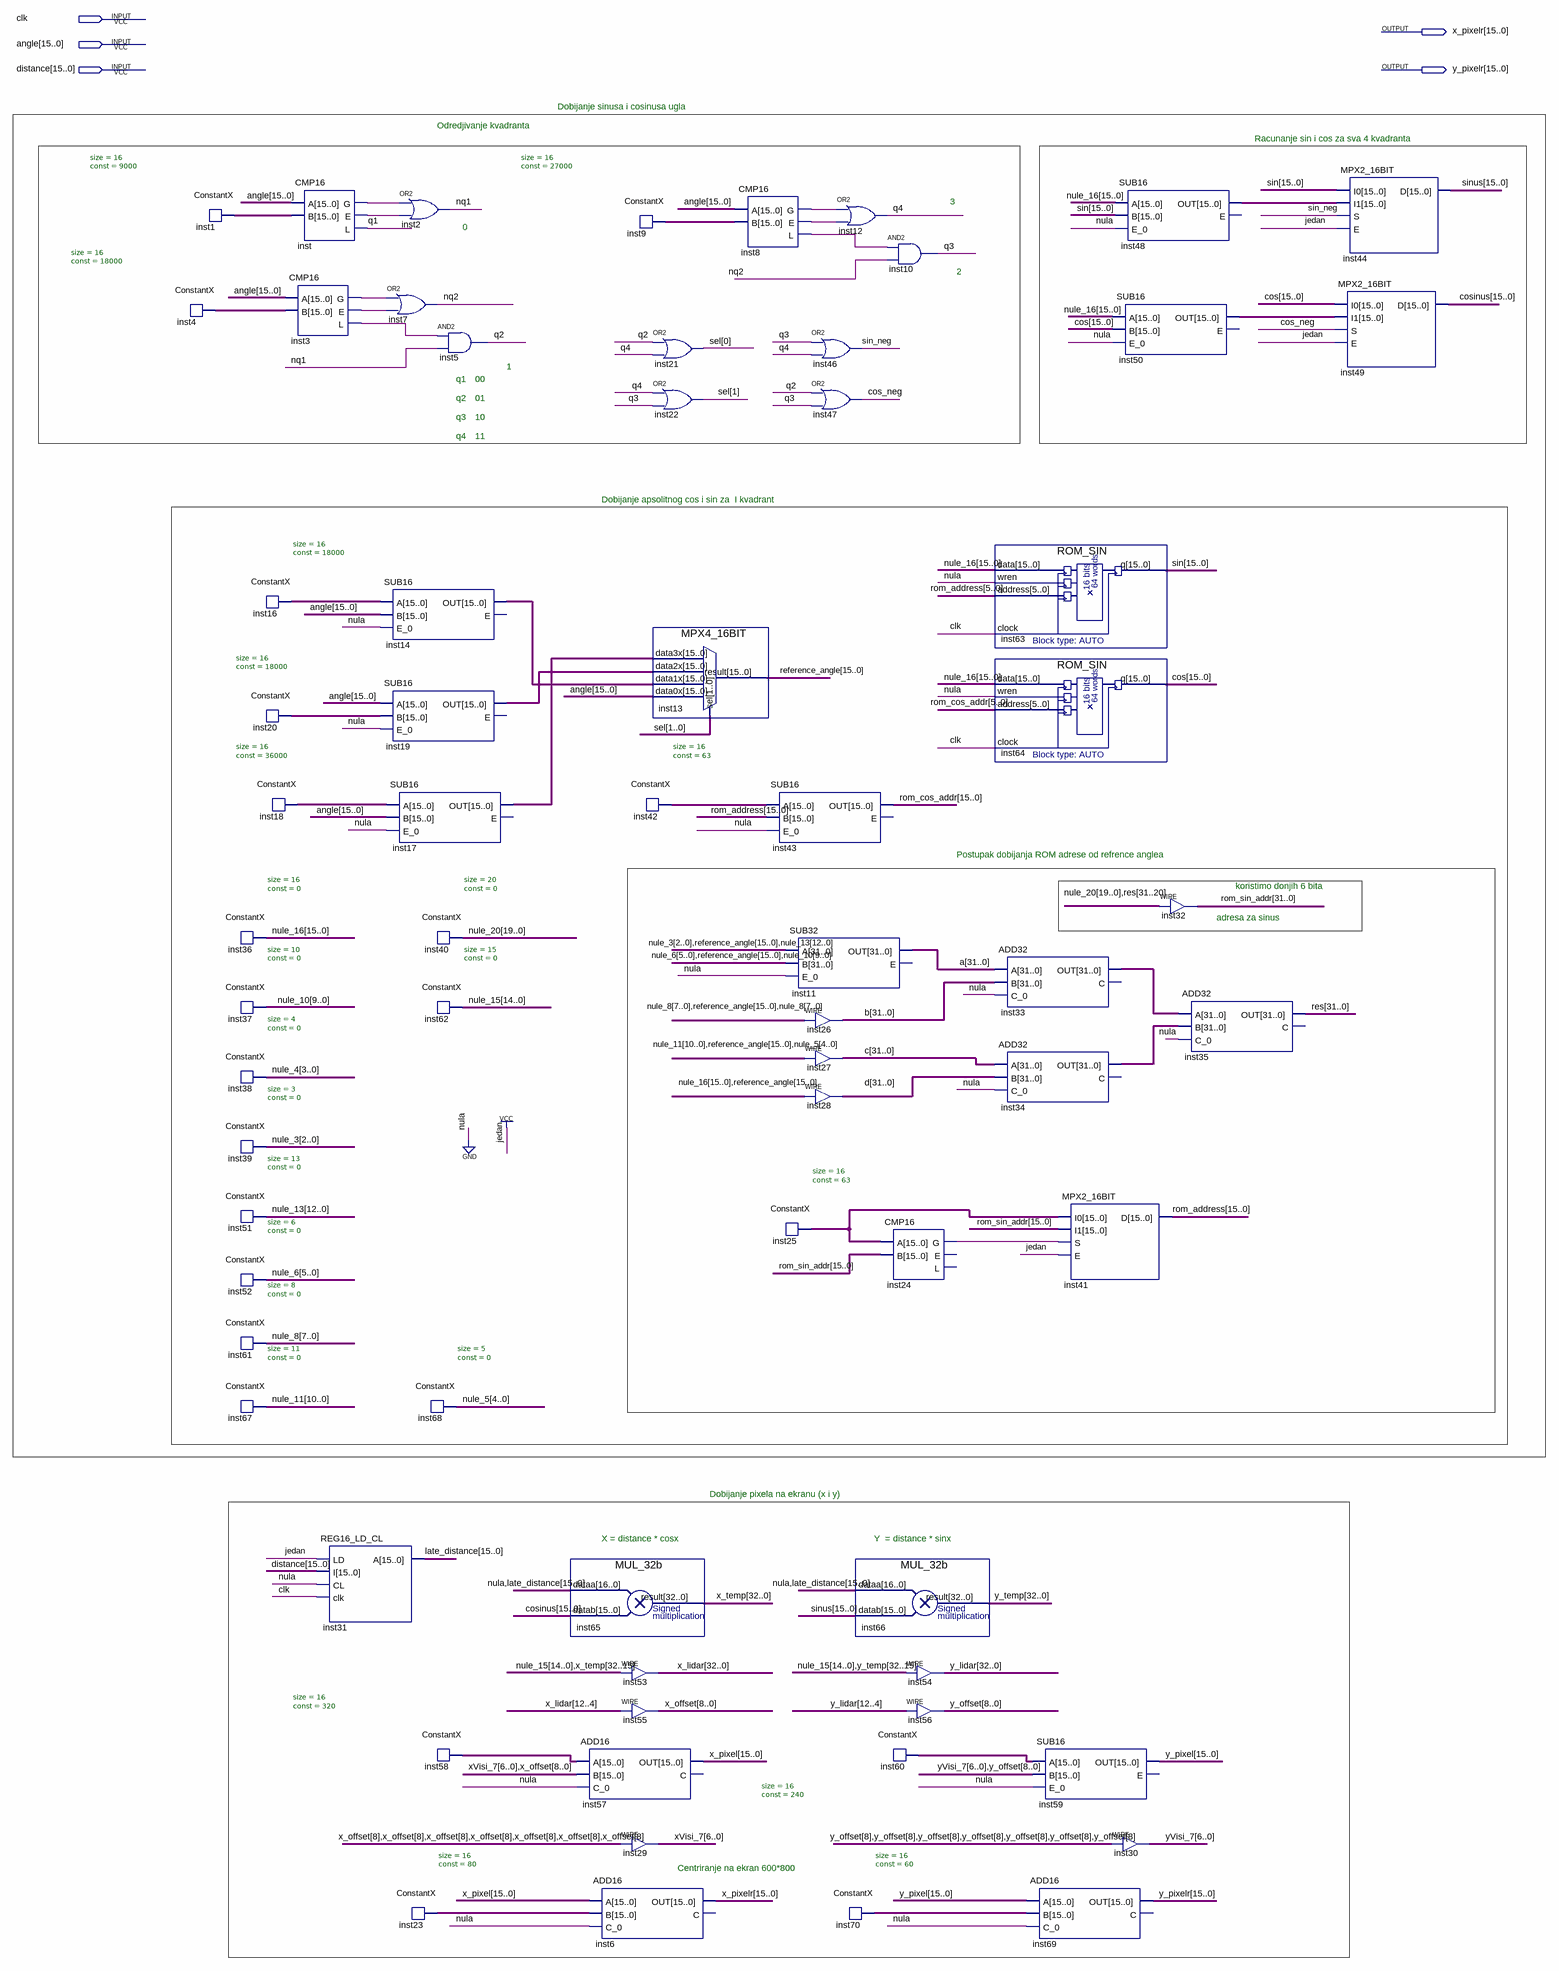
[diagram p0: schematic sheet]
// Quartus schematic CalculateXY.bdf as structural Verilog: 69 symbols, 5 pins
module CalculateXY (
  input  clk,
  input  [15:0] angle,
  input  [15:0] distance,
  output [15:0] x_pixelr,
  output [15:0] y_pixelr
);

  wire cos_neg, inst3_e, inst3_g, inst3_l, inst8_e, inst8_g, inst8_l, inst24_g, inst_e, inst_g, nq1, nq2, q1,
       q2, q3, q4, sin_neg;
  wire [1:0] sel;
  wire [2:0] nule_3;
  wire [3:0] nule_4;
  wire [4:0] nule_5;
  wire [5:0] nule_6;
  wire [6:0] xVisi_7, yVisi_7;
  wire [7:0] nule_8;
  wire [8:0] x_offset, y_offset;
  wire [9:0] nule_10;
  wire [10:0] nule_11;
  wire [12:0] nule_13;
  wire [14:0] nule_15;
  wire [15:0] cos, cosinus, inst1_data_out, inst4_data_out, inst9_data_out, inst14_out, inst16_data_out,
       inst17_out, inst18_data_out, inst19_out, inst20_data_out, inst23_data_out, inst25_data_out,
       inst42_data_out, inst48_out, inst50_out, inst58_data_out, inst60_data_out, inst70_data_out,
       late_distance, nule_16, reference_angle, rom_address, rom_cos_addr, sin, sinus, x_pixel, y_pixel;
  wire [19:0] nule_20;
  wire [31:0] a, b, c, d, inst33_out, inst34_out, res, rom_sin_addr;
  wire [32:0] x_lidar, x_temp, y_lidar, y_temp;

  ConstantX #(.size(16), .\const (9000)) inst1 (.DATA_OUT(inst1_data_out));
  ConstantX #(.size(16), .\const (18000)) inst4 (.DATA_OUT(inst4_data_out));
  ConstantX #(.size(16), .\const (18000)) inst16 (.DATA_OUT(inst16_data_out));
  ConstantX #(.size(16), .\const (18000)) inst20 (.DATA_OUT(inst20_data_out));
  ConstantX #(.size(16), .\const (36000)) inst18 (.DATA_OUT(inst18_data_out));
  ConstantX #(.size(16), .\const (0)) inst36 (.DATA_OUT(nule_16));
  ConstantX #(.size(10), .\const (0)) inst37 (.DATA_OUT(nule_10));
  ConstantX #(.size(4), .\const (0)) inst38 (.DATA_OUT(nule_4));
  ConstantX #(.size(3), .\const (0)) inst39 (.DATA_OUT(nule_3));
  ConstantX #(.size(13), .\const (0)) inst51 (.DATA_OUT(nule_13));
  ConstantX #(.size(6), .\const (0)) inst52 (.DATA_OUT(nule_6));
  ConstantX #(.size(8), .\const (0)) inst61 (.DATA_OUT(nule_8));
  ConstantX #(.size(11), .\const (0)) inst67 (.DATA_OUT(nule_11));
  CMP16 inst (.A(angle), .B(inst1_data_out), .G(inst_g), .E(inst_e), .L(q1));
  CMP16 inst3 (.A(angle), .B(inst4_data_out), .G(inst3_g), .E(inst3_e), .L(inst3_l));
  REG16_LD_CL inst31 (.LD(1'b1), .I(distance), .CL(1'b0), .clk(clk), .A(late_distance));
  or inst2 (nq1, inst_g, inst_e);
  or inst7 (nq2, inst3_g, inst3_e);
  SUB16 inst14 (.A(inst16_data_out), .B(angle), .E_0(1'b0), .OUT(inst14_out));  // open: E
  SUB16 inst19 (.A(angle), .B(inst20_data_out), .E_0(1'b0), .OUT(inst19_out));  // open: E
  SUB16 inst17 (.A(inst18_data_out), .B(angle), .E_0(1'b0), .OUT(inst17_out));  // open: E
  ConstantX #(.size(16), .\const (80)) inst23 (.DATA_OUT(inst23_data_out));
  and inst5 (q2, inst3_l, nq1);
  ConstantX #(.size(20), .\const (0)) inst40 (.DATA_OUT(nule_20));
  ConstantX #(.size(15), .\const (0)) inst62 (.DATA_OUT(nule_15));
  ConstantX #(.size(5), .\const (0)) inst68 (.DATA_OUT(nule_5));
  ConstantX #(.size(16), .\const (320)) inst58 (.DATA_OUT(inst58_data_out));
  MUL_32b inst65 (.dataa({1'b0, late_distance}), .datab(cosinus), .result(x_temp));
  ADD16 inst57 (.A(inst58_data_out), .B({xVisi_7, x_offset}), .C_0(1'b0), .OUT(x_pixel));  // open: C
  ADD16 inst6 (.A(x_pixel), .B(inst23_data_out), .C_0(1'b0), .OUT(x_pixelr));  // open: C
  ConstantX #(.size(16), .\const (27000)) inst9 (.DATA_OUT(inst9_data_out));
  or inst21 (sel[0], q2, q4);
  or inst22 (sel[1], q4, q3);
  MPX4_16BIT inst13 (
    .data3x(inst17_out), .data2x(inst19_out), .data1x(inst14_out), .data0x(angle), .sel(sel),
    .result(reference_angle));
  ConstantX #(.size(16), .\const (63)) inst42 (.DATA_OUT(inst42_data_out));
  assign x_lidar = {nule_15, x_temp[32:15]};  // WIRE inst53
  assign x_offset = x_lidar[12:4];  // WIRE inst55
  assign xVisi_7 = {7{x_offset[8]}};  // WIRE inst29
  CMP16 inst8 (.A(angle), .B(inst9_data_out), .G(inst8_g), .E(inst8_e), .L(inst8_l));
  or inst46 (sin_neg, q3, q4);
  or inst47 (cos_neg, q2, q3);
  SUB16 inst43 (.A(inst42_data_out), .B(rom_address), .E_0(1'b0), .OUT(rom_cos_addr));  // open: E
  SUB32 inst11 (
    .A({nule_3, reference_angle, nule_13}), .B({nule_6, reference_angle, nule_10}), .E_0(1'b0), .OUT(a));  // open: E
  assign b = {nule_8, reference_angle, nule_8};  // WIRE inst26
  assign c = {nule_11, reference_angle, nule_5};  // WIRE inst27
  assign d = {nule_16, reference_angle};  // WIRE inst28
  ConstantX #(.size(16), .\const (63)) inst25 (.DATA_OUT(inst25_data_out));
  or inst12 (q4, inst8_g, inst8_e);
  MUL_32b inst66 (.dataa({1'b0, late_distance}), .datab(sinus), .result(y_temp));
  ConstantX #(.size(16), .\const (60)) inst70 (.DATA_OUT(inst70_data_out));
  and inst10 (q3, inst8_l, nq2);
  CMP16 inst24 (.A(inst25_data_out), .B(rom_sin_addr[15:0]), .G(inst24_g));  // open: E, L
  assign y_lidar = {nule_15, y_temp[32:15]};  // WIRE inst54
  assign y_offset = y_lidar[12:4];  // WIRE inst56
  ConstantX #(.size(16), .\const (240)) inst60 (.DATA_OUT(inst60_data_out));
  ROM_SIN inst63 (.data(nule_16), .wren(1'b0), .address(rom_address[5:0]), .clock(clk), .q(sin));
  ROM_SIN inst64 (.data(nule_16), .wren(1'b0), .address(rom_cos_addr[5:0]), .clock(clk), .q(cos));
  ADD32 inst33 (.A(a), .B(b), .C_0(1'b0), .OUT(inst33_out));  // open: C
  ADD32 inst34 (.A(c), .B(d), .C_0(1'b0), .OUT(inst34_out));  // open: C
  MPX2_16BIT inst41 (.I0(inst25_data_out), .I1(rom_sin_addr[15:0]), .S(inst24_g), .E(1'b1), .D(rom_address));
  SUB16 inst59 (.A(inst60_data_out), .B({yVisi_7, y_offset}), .E_0(1'b0), .OUT(y_pixel));  // open: E
  ADD16 inst69 (.A(y_pixel), .B(inst70_data_out), .C_0(1'b0), .OUT(y_pixelr));  // open: C
  SUB16 inst48 (.A(nule_16), .B(sin), .E_0(1'b0), .OUT(inst48_out));  // open: E
  SUB16 inst50 (.A(nule_16), .B(cos), .E_0(1'b0), .OUT(inst50_out));  // open: E
  assign yVisi_7 = {7{y_offset[8]}};  // WIRE inst30
  assign rom_sin_addr = {nule_20, res[31:20]};  // WIRE inst32
  ADD32 inst35 (.A(inst33_out), .B(inst34_out), .C_0(1'b0), .OUT(res));  // open: C
  MPX2_16BIT inst44 (.I0(sin), .I1(inst48_out), .S(sin_neg), .E(1'b1), .D(sinus));
  MPX2_16BIT inst49 (.I0(cos), .I1(inst50_out), .S(cos_neg), .E(1'b1), .D(cosinus));

  // Notes on the sheet:
  //   Dobijanje sinusa i cosinusa ugla
  //   Odredjivanje kvadranta
  //   Racunanje sin i cos za sva 4 kvadranta
  //   3
  //   0
  //   2
  //   1
  //   q1
  //   00
  //   q2
  //   01
  //   q3
  //   10
  //   q4
  //   11
  //   Dobijanje apsolitnog cos i sin za  I kvadrant
  //   Postupak dobijanja ROM adrese od refrence anglea
  //   koristimo donjih 6 bita
  //   adresa za sinus
  //   Dobijanje pixela na ekranu (x i y)
  //   X = distance * cosx
  //   Y  = distance * sinx
  //   Centriranje na ekran 600*800
endmodule
